# Altium project InterfaceB.PrjPcb (part 2 of 2)
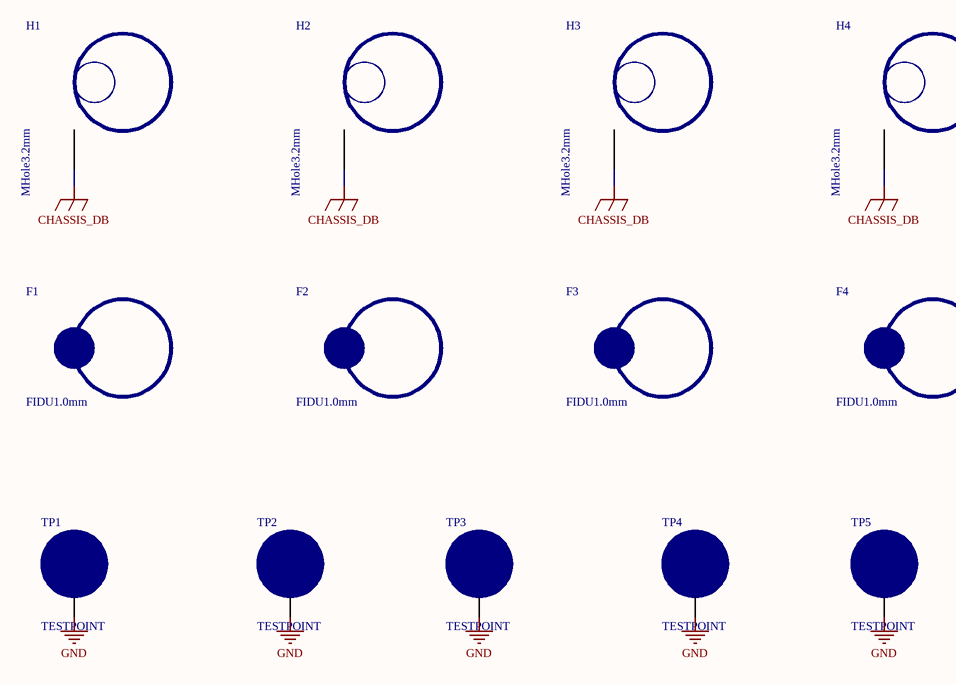
[diagram p12: Mechanical.SchDoc]

## Nets that join several sheets
+1V2: Power (R71.1), InterfacesB_RGMII_Ethernet (L2.1 L4.1 Q1.3)
+2V5: Power (R73.1 R77.1), InterfacesB_RGMII_Ethernet (5 pins)
+3V3: Power (9 pins), InterfacesB_FPGA (41 pins), InterfacesB_Decoupling (26 pins), InterfacesB_NONISO232a (10 pins), InterfacesB_NONISO232b (10 pins), InterfacesB_NONISO422a (10 pins), InterfacesB_NONISO422b (10 pins), InterfacesB_RGMII_Ethernet (14 pins), InterfacesA_USBFTDI (D1.1 D2.1 R1.1), InterfacesB_SHIFTER_LEDS (16 pins), InterfacesB_CONNECTORS (5 pins)
+5V0: Power (6 pins), InterfacesA_USBFTDI (C1.1 C2.2 U1.20)
CHASSIS_DB: InterfacesB_CONNECTORS (16 pins), Mechanical (H1.1 H2.1 H3.1 H4.1)
GND: Power (36 pins), InterfacesB_FPGA (14 pins), InterfacesB_Decoupling (26 pins), InterfacesB_NONISO232a (10 pins), InterfacesB_NONISO232b (10 pins), InterfacesB_NONISO422a (6 pins), InterfacesB_NONISO422b (6 pins), InterfacesB_RGMII_Ethernet (36 pins), InterfacesA_USBFTDI (10 pins), InterfacesB_SHIFTER_LEDS (16 pins), InterfacesB_CONNECTORS (14 pins), Mechanical (5 pins)
BRS422_RX0_N: InterfacesB_NONISO422b (R19.1 U10.1), InterfacesB_CONNECTORS (J1.6)
BRS422_RX0_P: InterfacesB_NONISO422b (R19.2 U10.2), InterfacesB_CONNECTORS (J1.7)
BRS422_RX1_N: InterfacesB_NONISO422b (R20.1 U10.7), InterfacesB_CONNECTORS (J2.6)
BRS422_RX1_P: InterfacesB_NONISO422b (R20.2 U10.6), InterfacesB_CONNECTORS (J2.7)
BRS422_RX2_N: InterfacesB_NONISO422b (R82.1 U10.9), InterfacesB_CONNECTORS (J3.6)
BRS422_RX2_P: InterfacesB_NONISO422b (R82.2 U10.10), InterfacesB_CONNECTORS (J3.7)
BRS422_RX3_N: InterfacesB_NONISO422b (R83.1 U10.15), InterfacesB_CONNECTORS (J4.6)
BRS422_RX3_P: InterfacesB_NONISO422b (R83.2 U10.14), InterfacesB_CONNECTORS (J4.7)
BRS422_RX4_N: InterfacesB_NONISO422b (R84.1 U11.1), InterfacesB_CONNECTORS (J5.6)
BRS422_RX4_P: InterfacesB_NONISO422b (R84.2 U11.2), InterfacesB_CONNECTORS (J5.7)
BRS422_RX5_N: InterfacesB_NONISO422b (R85.1 U11.7), InterfacesB_CONNECTORS (J6.6)
BRS422_RX5_P: InterfacesB_NONISO422b (R85.2 U11.6), InterfacesB_CONNECTORS (J6.7)
BRS422_RX6_N: InterfacesB_NONISO422b (R86.1 U11.9), InterfacesB_CONNECTORS (J7.6)
BRS422_RX6_P: InterfacesB_NONISO422b (R86.2 U11.10), InterfacesB_CONNECTORS (J7.7)
BRS422_RX7_N: InterfacesB_NONISO422b (R87.1 U11.15), InterfacesB_CONNECTORS (J8.6)
BRS422_RX7_P: InterfacesB_NONISO422b (R87.2 U11.14), InterfacesB_CONNECTORS (J8.7)
BRS422_TX0_N: InterfacesB_NONISO422a (U8.3), InterfacesB_CONNECTORS (J1.1)
BRS422_TX0_P: InterfacesB_NONISO422a (U8.2), InterfacesB_CONNECTORS (J1.2)
BRS422_TX1_N: InterfacesB_NONISO422a (U8.5), InterfacesB_CONNECTORS (J2.1)
BRS422_TX1_P: InterfacesB_NONISO422a (U8.6), InterfacesB_CONNECTORS (J2.2)
BRS422_TX2_N: InterfacesB_NONISO422a (U8.11), InterfacesB_CONNECTORS (J3.1)
BRS422_TX2_P: InterfacesB_NONISO422a (U8.10), InterfacesB_CONNECTORS (J3.2)
BRS422_TX3_N: InterfacesB_NONISO422a (U8.13), InterfacesB_CONNECTORS (J4.1)
BRS422_TX3_P: InterfacesB_NONISO422a (U8.14), InterfacesB_CONNECTORS (J4.2)
BRS422_TX4_N: InterfacesB_NONISO422a (U9.3), InterfacesB_CONNECTORS (J5.1)
BRS422_TX4_P: InterfacesB_NONISO422a (U9.2), InterfacesB_CONNECTORS (J5.2)
BRS422_TX5_N: InterfacesB_NONISO422a (U9.5), InterfacesB_CONNECTORS (J6.1)
BRS422_TX5_P: InterfacesB_NONISO422a (U9.6), InterfacesB_CONNECTORS (J6.2)
BRS422_TX6_N: InterfacesB_NONISO422a (U9.11), InterfacesB_CONNECTORS (J7.1)
BRS422_TX6_P: InterfacesB_NONISO422a (U9.10), InterfacesB_CONNECTORS (J7.2)
BRS422_TX7_N: InterfacesB_NONISO422a (U9.13), InterfacesB_CONNECTORS (J8.1)
BRS422_TX7_P: InterfacesB_NONISO422a (U9.14), InterfacesB_CONNECTORS (J8.2)
CLK_ENET_25: InterfacesB_FPGA (U3.88), InterfacesB_RGMII_Ethernet (R11.2 R12.2)
CLKB_100: InterfacesB_FPGA (U3.110), InterfacesB_CONNECTORS (U2.3)
CNL_MODE: InterfacesB_FPGA (U3.87), InterfacesB_RGMII_Ethernet (R23.1 R24.2 U12.41)
FPGA_BRS232_RX0: InterfacesB_FPGA (U3.39), InterfacesB_NONISO232a (U4.16)
FPGA_BRS232_RX1: InterfacesB_FPGA (U3.38), InterfacesB_NONISO232a (U4.9)
FPGA_BRS232_RX2: InterfacesB_FPGA (U3.133), InterfacesB_NONISO232a (U5.16)
FPGA_BRS232_RX3: InterfacesB_FPGA (U3.141), InterfacesB_NONISO232a (U5.9)
FPGA_BRS232_RX4: InterfacesB_FPGA (U3.61), InterfacesB_NONISO232b (U6.16)
FPGA_BRS232_RX5: InterfacesB_FPGA (U3.62), InterfacesB_NONISO232b (U6.9)
FPGA_BRS232_RX6: InterfacesB_FPGA (U3.53), InterfacesB_NONISO232b (U7.16)
FPGA_BRS232_RX7: InterfacesB_FPGA (U3.55), InterfacesB_NONISO232b (U7.9)
FPGA_BRS232_TX0: InterfacesB_FPGA (U3.33), InterfacesB_NONISO232a (U4.13)
FPGA_BRS232_TX1: InterfacesB_FPGA (U3.32), InterfacesB_NONISO232a (U4.12)
FPGA_BRS232_TX2: InterfacesB_FPGA (U3.134), InterfacesB_NONISO232a (U5.13)
FPGA_BRS232_TX3: InterfacesB_FPGA (U3.135), InterfacesB_NONISO232a (U5.12)
FPGA_BRS232_TX4: InterfacesB_FPGA (U3.84), InterfacesB_NONISO232b (U6.13)
FPGA_BRS232_TX5: InterfacesB_FPGA (U3.83), InterfacesB_NONISO232b (U6.12)
FPGA_BRS232_TX6: InterfacesB_FPGA (U3.52), InterfacesB_NONISO232b (U7.13)
FPGA_BRS232_TX7: InterfacesB_FPGA (U3.51), InterfacesB_NONISO232b (U7.12)
FPGA_BRS422_RX0: InterfacesB_FPGA (U3.27), InterfacesB_NONISO422b (U10.3)
FPGA_BRS422_RX1: InterfacesB_FPGA (U3.26), InterfacesB_NONISO422b (U10.5)
FPGA_BRS422_RX2: InterfacesB_FPGA (U3.25), InterfacesB_NONISO422b (U10.11)
FPGA_BRS422_RX3: InterfacesB_FPGA (U3.28), InterfacesB_NONISO422b (U10.13)
FPGA_BRS422_RX4: InterfacesB_FPGA (U3.86), InterfacesB_NONISO422b (U11.3)
FPGA_BRS422_RX5: InterfacesB_FPGA (U3.85), InterfacesB_NONISO422b (U11.5)
FPGA_BRS422_RX6: InterfacesB_FPGA (U3.80), InterfacesB_NONISO422b (U11.11)
FPGA_BRS422_RX7: InterfacesB_FPGA (U3.82), InterfacesB_NONISO422b (U11.13)
FPGA_BRS422_TX0: InterfacesB_FPGA (U3.7), InterfacesB_NONISO422a (U8.1)
FPGA_BRS422_TX1: InterfacesB_FPGA (U3.140), InterfacesB_NONISO422a (U8.7)
FPGA_BRS422_TX2: InterfacesB_FPGA (U3.6), InterfacesB_NONISO422a (U8.9)
FPGA_BRS422_TX3: InterfacesB_FPGA (U3.8), InterfacesB_NONISO422a (U8.15)
FPGA_BRS422_TX4: InterfacesB_FPGA (U3.60), InterfacesB_NONISO422a (U9.1)
FPGA_BRS422_TX5: InterfacesB_FPGA (U3.64), InterfacesB_NONISO422a (U9.7)
FPGA_BRS422_TX6: InterfacesB_FPGA (U3.58), InterfacesB_NONISO422a (U9.9)
FPGA_BRS422_TX7: InterfacesB_FPGA (U3.63), InterfacesB_NONISO422a (U9.15)
FPGA_FPGA0: InterfacesB_FPGA (U3.40), InterfacesB_CONNECTORS (J10.2)
FPGA_FPGA1: InterfacesB_FPGA (U3.41), InterfacesB_CONNECTORS (J10.3)
FPGA_FPGA2: InterfacesB_FPGA (U3.42), InterfacesB_CONNECTORS (J10.4)
FPGA_FPGA3: InterfacesB_FPGA (U3.43), InterfacesB_CONNECTORS (J10.5)
FTDI_RXDA: InterfacesB_FPGA (U3.49), InterfacesA_USBFTDI (U1.5)
FTDI_TXDA: InterfacesB_FPGA (U3.46), InterfacesA_USBFTDI (U1.1)
GTX_CLK: InterfacesB_FPGA (U3.111), InterfacesB_RGMII_Ethernet (R27.1 R28.2 U12.24)
INT_N: InterfacesB_FPGA (U3.90), InterfacesB_RGMII_Ethernet (R13.1 U12.38)
L0: InterfacesB_FPGA (U3.77), InterfacesB_SHIFTER_LEDS (D3.2 R49.2)
L1: InterfacesB_FPGA (U3.76), InterfacesB_SHIFTER_LEDS (D4.2 R50.2)
L2: InterfacesB_FPGA (U3.75), InterfacesB_SHIFTER_LEDS (D5.2 R53.2)
L3: InterfacesB_FPGA (U3.74), InterfacesB_SHIFTER_LEDS (D6.2 R54.2)
L4: InterfacesB_FPGA (U3.70), InterfacesB_SHIFTER_LEDS (D7.2 R57.2)
L5: InterfacesB_FPGA (U3.69), InterfacesB_SHIFTER_LEDS (D8.2 R58.2)
L6: InterfacesB_FPGA (U3.66), InterfacesB_SHIFTER_LEDS (D9.2 R61.2)
L7: InterfacesB_FPGA (U3.65), InterfacesB_SHIFTER_LEDS (D10.2 R62.2)
MDC: InterfacesB_FPGA (U3.118), InterfacesB_RGMII_Ethernet (R14.1 U12.36)
MDIO: InterfacesB_FPGA (U3.91), InterfacesB_RGMII_Ethernet (R15.1 U12.37)
OUT_BRS232_RX0: InterfacesB_NONISO232a (U4.15), InterfacesB_CONNECTORS (J1.9)
OUT_BRS232_RX1: InterfacesB_NONISO232a (U4.10), InterfacesB_CONNECTORS (J2.9)
OUT_BRS232_RX2: InterfacesB_NONISO232a (U5.15), InterfacesB_CONNECTORS (J3.9)
OUT_BRS232_RX3: InterfacesB_NONISO232a (U5.10), InterfacesB_CONNECTORS (J4.9)
OUT_BRS232_RX4: InterfacesB_NONISO232b (U6.15), InterfacesB_CONNECTORS (J5.9)
OUT_BRS232_RX5: InterfacesB_NONISO232b (U6.10), InterfacesB_CONNECTORS (J6.9)
OUT_BRS232_RX6: InterfacesB_NONISO232b (U7.15), InterfacesB_CONNECTORS (J7.9)
OUT_BRS232_RX7: InterfacesB_NONISO232b (U7.10), InterfacesB_CONNECTORS (J8.9)
OUT_BRS232_TX0: InterfacesB_NONISO232a (U4.17), InterfacesB_CONNECTORS (J1.4)
OUT_BRS232_TX1: InterfacesB_NONISO232a (U4.8), InterfacesB_CONNECTORS (J2.4)
OUT_BRS232_TX2: InterfacesB_NONISO232a (U5.17), InterfacesB_CONNECTORS (J3.4)
OUT_BRS232_TX3: InterfacesB_NONISO232a (U5.8), InterfacesB_CONNECTORS (J4.4)
OUT_BRS232_TX4: InterfacesB_NONISO232b (U6.17), InterfacesB_CONNECTORS (J5.4)
OUT_BRS232_TX5: InterfacesB_NONISO232b (U6.8), InterfacesB_CONNECTORS (J6.4)
OUT_BRS232_TX6: InterfacesB_NONISO232b (U7.17), InterfacesB_CONNECTORS (J7.4)
OUT_BRS232_TX7: InterfacesB_NONISO232b (U7.8), InterfacesB_CONNECTORS (J8.4)
RESET_N: InterfacesB_FPGA (U3.89), InterfacesB_RGMII_Ethernet (R16.1 U12.42)
RST_A: InterfacesB_FPGA (U3.50), InterfacesA_USBFTDI (R1.2 R2.1 U1.19)
RX_CLK: InterfacesB_FPGA (U3.117), InterfacesB_RGMII_Ethernet (R21.1 R22.2 U12.35)
RX_DATA0: InterfacesB_FPGA (U3.93), InterfacesB_RGMII_Ethernet (R29.1 R30.2 U12.32)
RX_DATA1: InterfacesB_FPGA (U3.96), InterfacesB_RGMII_Ethernet (R31.1 R32.2 U12.31)
RX_DATA2: InterfacesB_FPGA (U3.98), InterfacesB_RGMII_Ethernet (R33.1 R34.2 U12.28)
RX_DATA3: InterfacesB_FPGA (U3.99), InterfacesB_RGMII_Ethernet (R35.1 R36.2 U12.27)
RX_DV: InterfacesB_FPGA (U3.92), InterfacesB_RGMII_Ethernet (R25.1 R26.2 U12.33)
SWSELB_2: InterfacesB_FPGA (U3.123), InterfacesB_SHIFTER_LEDS (R65.1 SW1.14)
SWSELB_3: InterfacesB_FPGA (U3.127), InterfacesB_SHIFTER_LEDS (R66.1 SW1.13)
SWSELB_4: InterfacesB_FPGA (U3.128), InterfacesB_SHIFTER_LEDS (R67.1 SW1.12)
SWSELB_5: InterfacesB_FPGA (U3.129), InterfacesB_SHIFTER_LEDS (R68.1 SW1.11)
SWSELB_6: InterfacesB_FPGA (U3.131), InterfacesB_SHIFTER_LEDS (R69.1 SW1.10)
SWSELB_7: InterfacesB_FPGA (U3.132), InterfacesB_SHIFTER_LEDS (R70.1 SW1.9)
TCK_B: InterfacesB_FPGA (U3.17), InterfacesB_CONNECTORS (J9.1)
TDI_B: InterfacesB_FPGA (U3.18), InterfacesB_CONNECTORS (J9.3)
TDO_B: InterfacesB_FPGA (U3.19), InterfacesB_CONNECTORS (J9.9)
TMS_B: InterfacesB_FPGA (U3.16), InterfacesB_CONNECTORS (J9.5)
TX_DATA0: InterfacesB_FPGA (U3.106), InterfacesB_RGMII_Ethernet (U12.19)
TX_DATA1: InterfacesB_FPGA (U3.105), InterfacesB_RGMII_Ethernet (U12.20)
TX_DATA2: InterfacesB_FPGA (U3.102), InterfacesB_RGMII_Ethernet (U12.21)
TX_DATA3: InterfacesB_FPGA (U3.101), InterfacesB_RGMII_Ethernet (U12.22)
TX_EN: InterfacesB_FPGA (U3.100), InterfacesB_RGMII_Ethernet (U12.25)
USBA_N: Power (J12.2), InterfacesA_USBFTDI (U1.16)
USBA_P: Power (J12.3), InterfacesA_USBFTDI (U1.15)